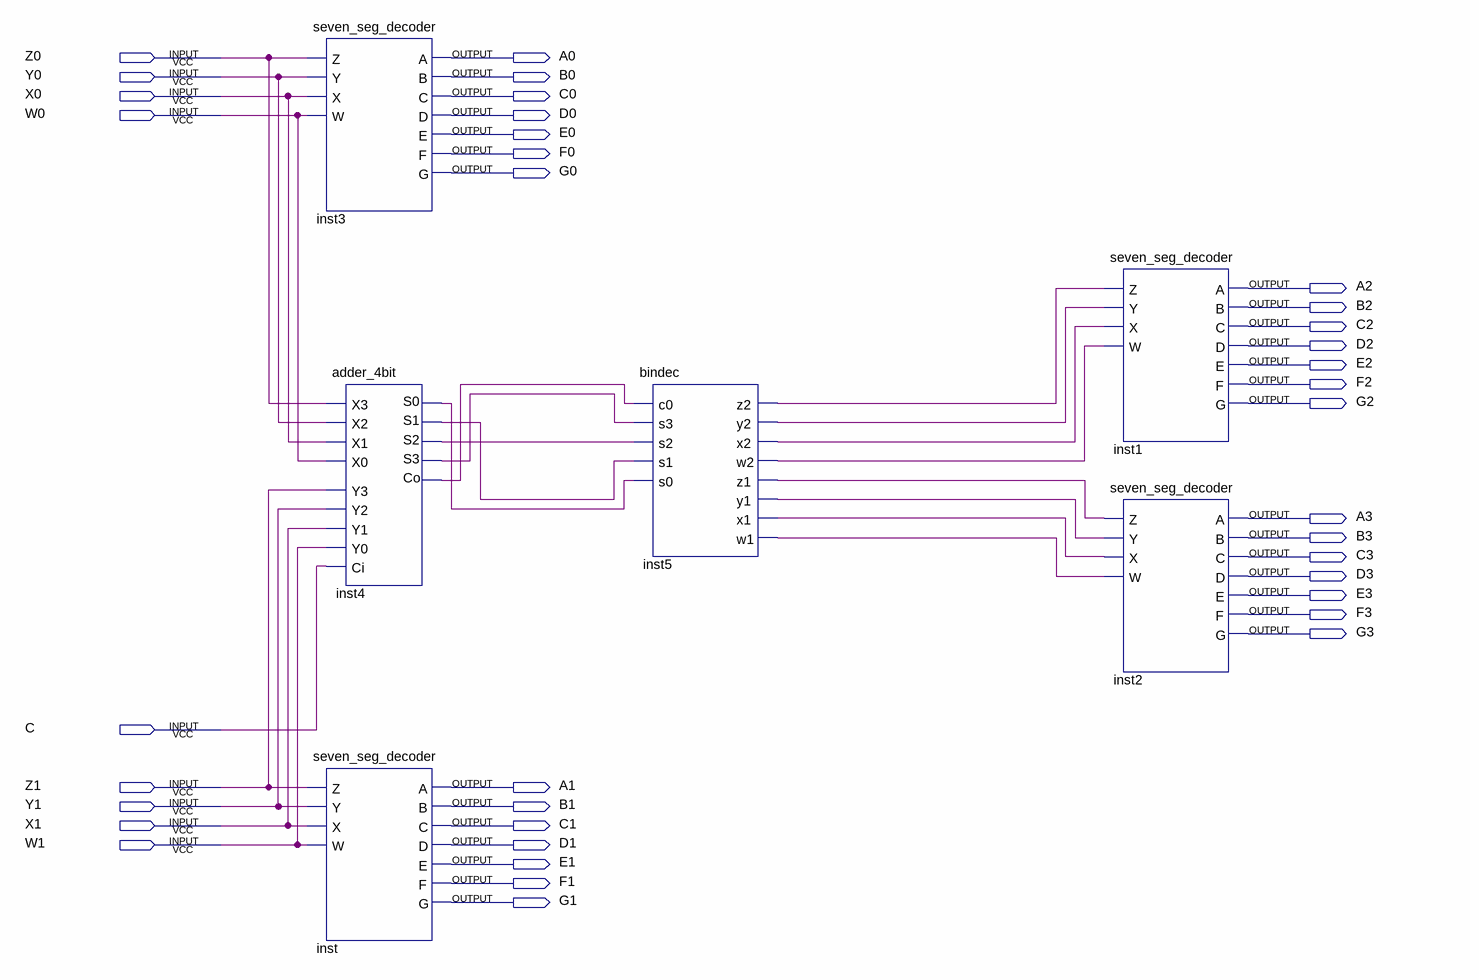
[diagram p0: schematic sheet]
// Quartus schematic Lab06.bdf as structural Verilog: 6 symbols, 37 pins
module Lab06 (
  input  Z0,
  input  Y0,
  input  X0,
  input  W0,
  input  C,
  input  Z1,
  input  Y1,
  input  X1,
  input  W1,
  output A0,
  output B0,
  output C0,
  output D0,
  output E0,
  output F0,
  output G0,
  output A2,
  output B2,
  output C2,
  output D2,
  output E2,
  output F2,
  output G2,
  output A3,
  output B3,
  output C3,
  output D3,
  output E3,
  output F3,
  output G3,
  output A1,
  output B1,
  output C1,
  output D1,
  output E1,
  output F1,
  output G1
);

  wire inst4_co, inst4_s0, inst4_s1, inst4_s2, inst4_s3, inst5_w1, inst5_w2, inst5_x1, inst5_x2, inst5_y1,
       inst5_y2, inst5_z1, inst5_z2;

  seven_seg_decoder inst3 (.Z(Z0), .Y(Y0), .X(X0), .W(W0), .A(A0), .B(B0), .C(C0), .D(D0), .E(E0), .F(F0), .G(G0));
  seven_seg_decoder inst (.Z(Z1), .Y(Y1), .X(X1), .W(W1), .A(A1), .B(B1), .C(C1), .D(D1), .E(E1), .F(F1), .G(G1));
  adder_4bit inst4 (
    .X3(Z0), .Y3(Z1), .X2(Y0), .Y2(Y1), .X1(X0), .Y1(X1), .X0(W0), .Y0(W1), .Ci(C), .S0(inst4_s0),
    .S1(inst4_s1), .S2(inst4_s2), .S3(inst4_s3), .Co(inst4_co));
  bindec inst5 (
    .c0(inst4_co), .s3(inst4_s3), .s2(inst4_s2), .s1(inst4_s1), .s0(inst4_s0), .z2(inst5_z2), .y2(inst5_y2),
    .x2(inst5_x2), .w2(inst5_w2), .z1(inst5_z1), .y1(inst5_y1), .x1(inst5_x1), .w1(inst5_w1));
  seven_seg_decoder inst1 (
    .Z(inst5_z2), .Y(inst5_y2), .X(inst5_x2), .W(inst5_w2), .A(A2), .B(B2), .C(C2), .D(D2), .E(E2), .F(F2),
    .G(G2));
  seven_seg_decoder inst2 (
    .Z(inst5_z1), .Y(inst5_y1), .X(inst5_x1), .W(inst5_w1), .A(A3), .B(B3), .C(C3), .D(D3), .E(E3), .F(F3),
    .G(G3));
endmodule
